# Altium schematic sheet Sensors.SchDoc
size A; SheetNumber: 1; SheetTotal: 1
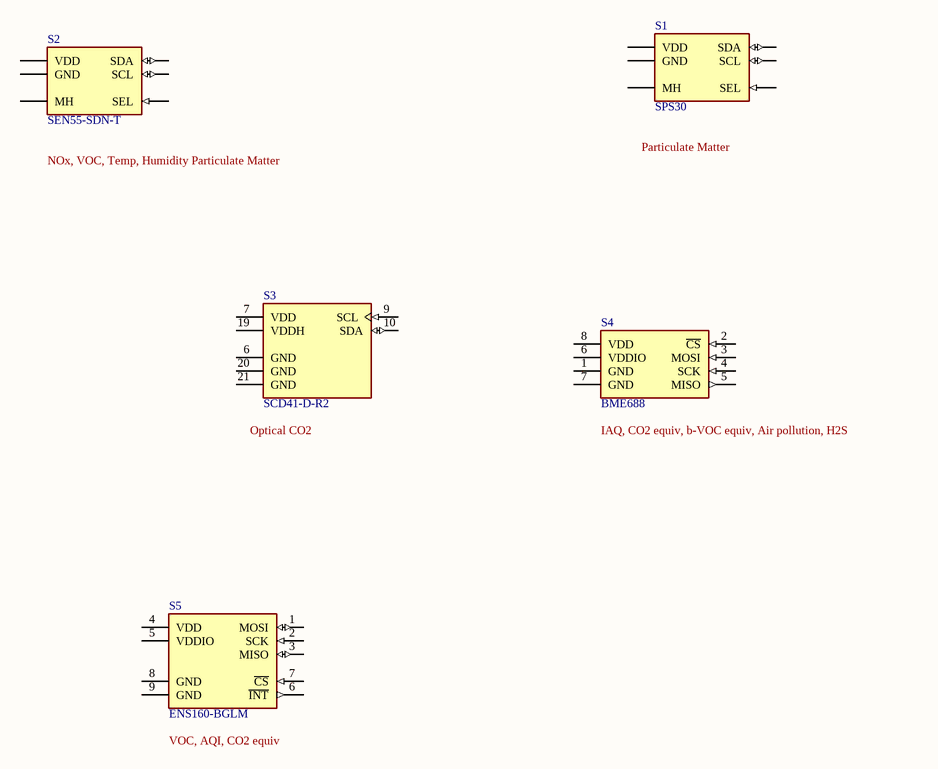
[diagram p0: Sensors.SchDoc]

## Parts
S1  SPS30  [[Gas Sensor] PM2.5 Particulate Matter]
S2  SEN55-SDN-T  [[Gas Sensor] NOx, Particulate Matter]
S3  SCD41-D-R2  [[Gas Sensor] CO2, Humidity, Temp]
S4  BME688  [[Gas Sensor] Gas, Humidity, Pressure, Temp]
S5  ENS160-BGLM  [[Gas Sensor] VOC, AQI]

## Nets

Not connected (* = marked no-connect by the designer): S1 1(VDD) 2(SDA) 3(SCL) 4(SEL) 5(GND) MH; S2 1(VDD) 2(GND) 3(SDA) 4(SCL) 5(SEL) MH; S3 6(GND) 7(VDD) 9(SCL) 10(SDA) 19(VDDH) 20(GND) 21(GND); S4 1(GND) 2(~{CS}) 3(MOSI) 4(SCK) 5(MISO) 6(VDDIO) 7(GND) 8(VDD); S5 1(MOSI) 2(SCK) 3(MISO) 4(VDD) 5(VDDIO) 6(~{INT}) 7(~{CS}) 8(GND) 9(GND)

## Notes on the sheet
- Particulate Matter
- NOx, VOC, Temp, Humidity Particulate Matter
- (near S3) Optical CO2
- (near S4) IAQ, CO2 equiv, b-VOC equiv, Air pollution, H2S
- (near S5) VOC, AQI, CO2 equiv

## Library data of the parts
S1 = [Gas Sensor] PM2.5 Particulate Matter: Supplier 1: DigiKey; Supplier Part Number 1: 1649-1106-ND
S2 = [Gas Sensor] NOx, Particulate Matter: Supplier 1: DigiKey; Supplier Part Number 1: 1649-SEN55-SDN-T-ND
S3 = [Gas Sensor] CO2, Humidity, Temp: Supplier 1: DigiKey; Supplier Part Number 1: 1649-SCD41-D-R2DKR-ND
S4 = [Gas Sensor] Gas, Humidity, Pressure, Temp: Supplier 1: DigiKey; Supplier Part Number 1: 828-BME688CT-ND
S5 = [Gas Sensor] VOC, AQI: Supplier 1: DigiKey; Supplier Part Number 1: 2618-ENS160-BGLMCT-ND